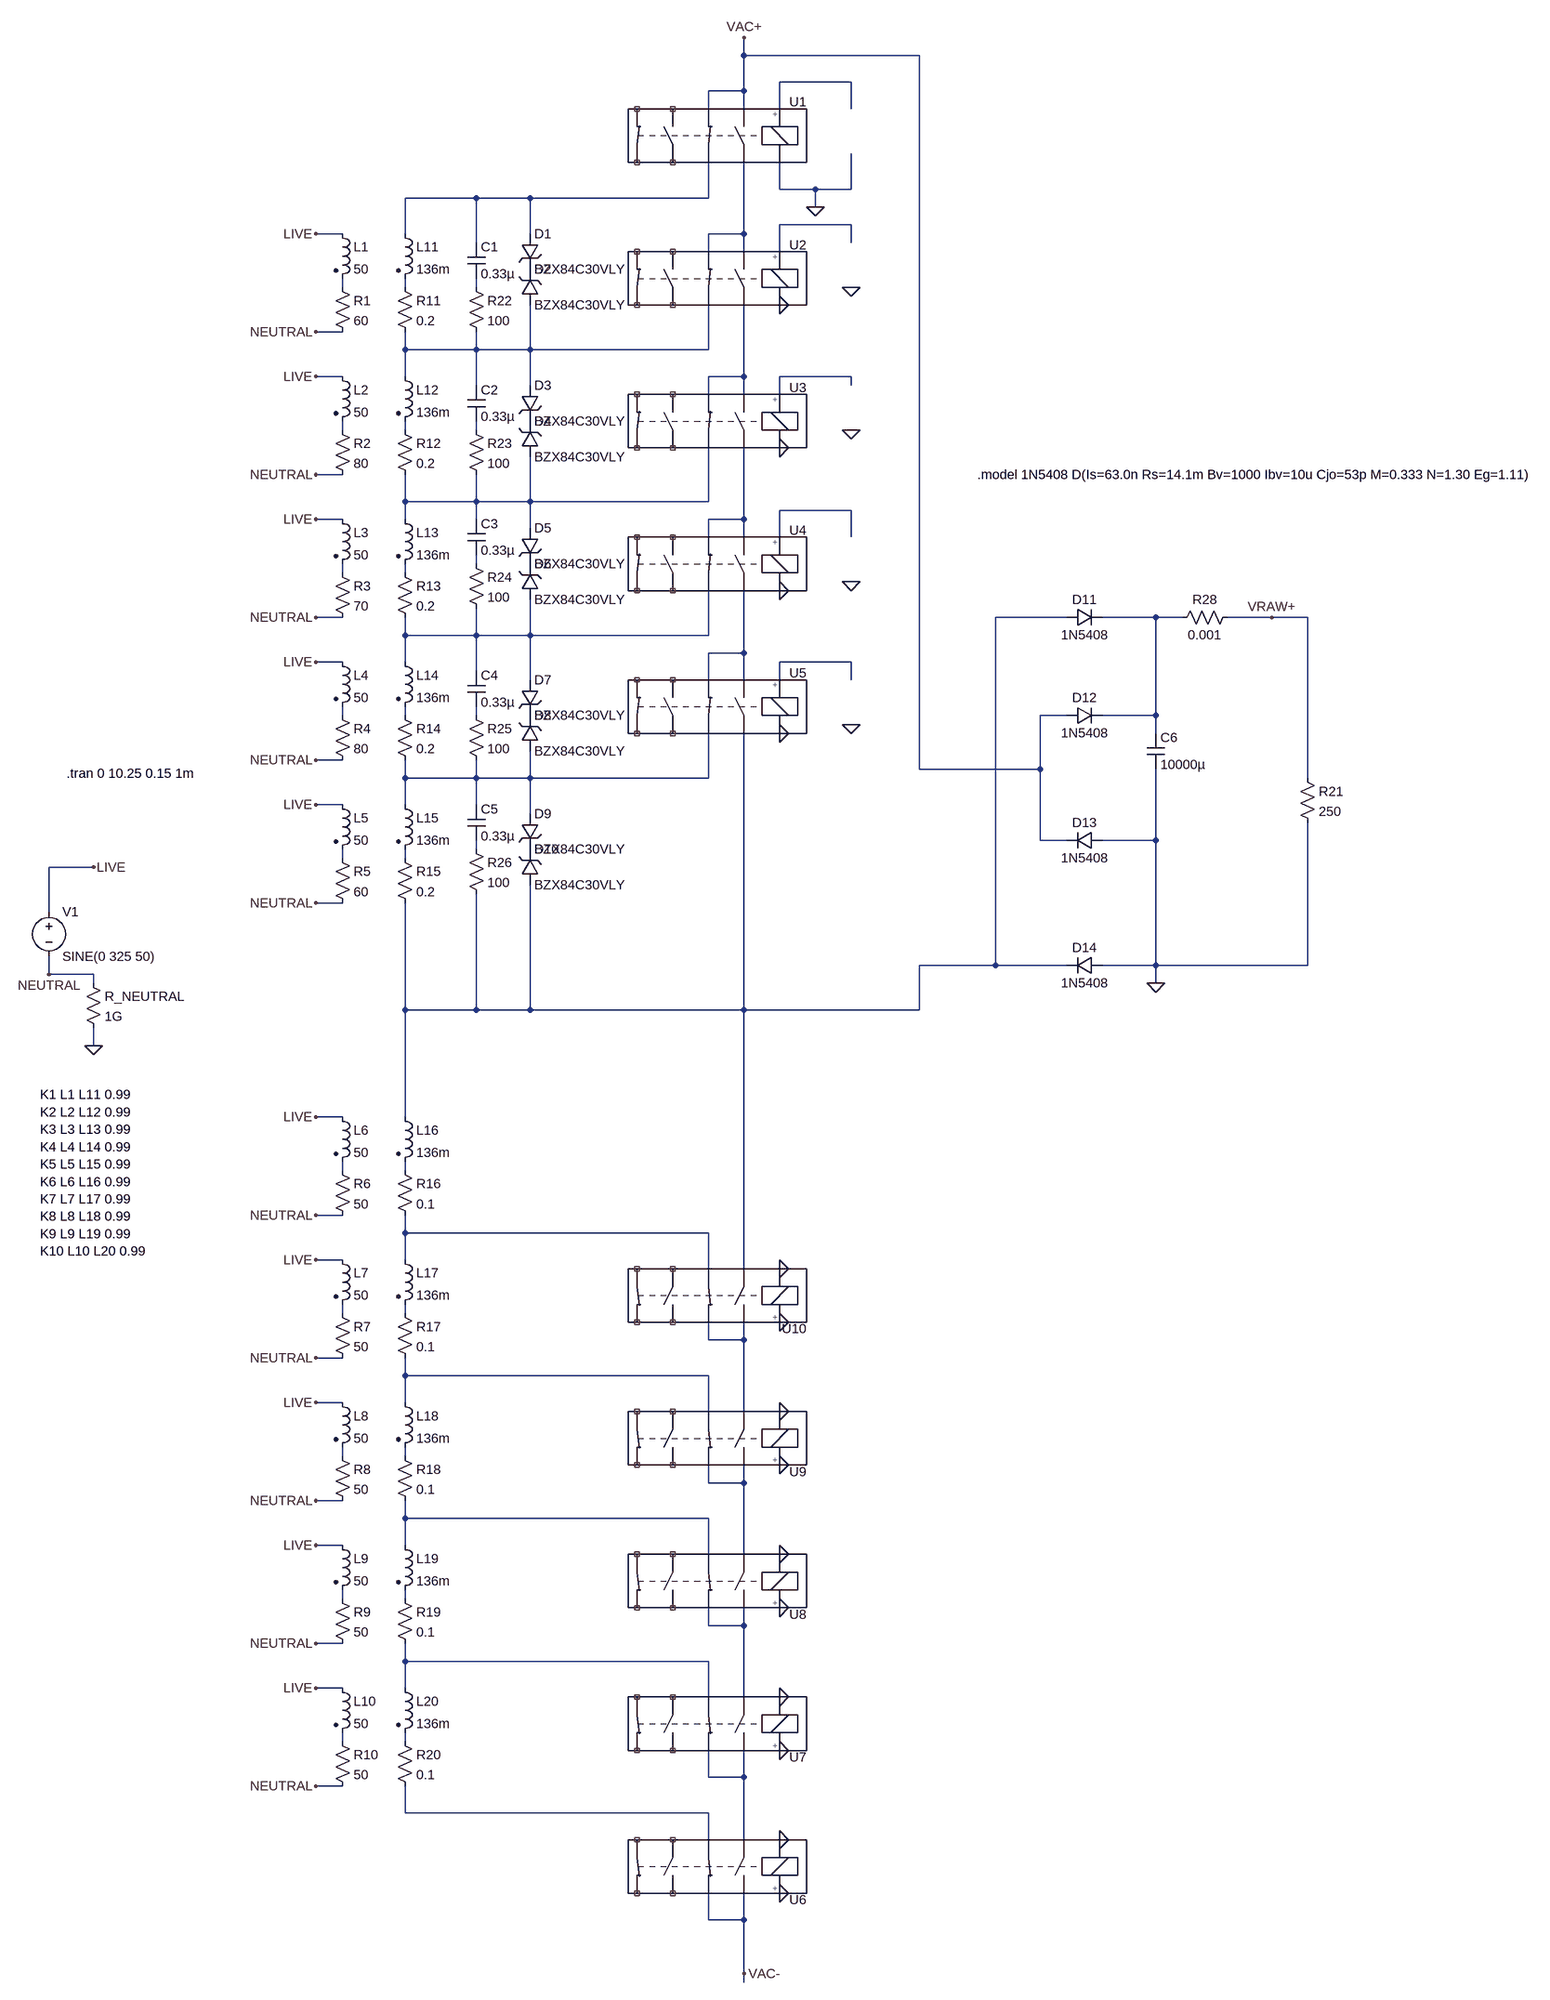
[diagram p0: schematic psu.asc]
psu.asc, the LTspice schematic file:
Version 4
SHEET 1 2216 3296
WIRE 496 -208 496 -240
WIRE 1056 -208 496 -208
WIRE 688 -160 560 -160
WIRE 496 -144 496 -208
WIRE 496 -144 432 -144
WIRE 432 -112 432 -144
WIRE 496 -112 496 -144
WIRE 560 -112 560 -160
WIRE 688 -112 688 -160
WIRE 560 32 560 -16
WIRE 624 32 560 32
WIRE 688 32 688 -32
WIRE 688 32 624 32
WIRE 16 48 -112 48
WIRE 112 48 16 48
WIRE 432 48 432 -16
WIRE 432 48 112 48
WIRE 624 64 624 32
WIRE 688 96 560 96
WIRE -224 112 -272 112
WIRE -112 112 -112 48
WIRE 112 112 112 48
WIRE 496 112 496 -16
WIRE 496 112 432 112
WIRE 16 128 16 48
WIRE 688 128 688 96
WIRE 432 144 432 112
WIRE 496 144 496 112
WIRE 560 144 560 96
WIRE -224 208 -224 192
WIRE -112 208 -112 192
WIRE 16 208 16 192
WIRE -224 288 -272 288
WIRE -112 320 -112 288
WIRE 16 320 16 288
WIRE 16 320 -112 320
WIRE 112 320 112 240
WIRE 112 320 16 320
WIRE 432 320 432 240
WIRE 432 320 112 320
WIRE -224 368 -272 368
WIRE -112 368 -112 320
WIRE 496 368 496 240
WIRE 496 368 432 368
WIRE 688 368 560 368
WIRE 16 384 16 320
WIRE 112 384 112 320
WIRE 688 384 688 368
WIRE 432 400 432 368
WIRE 496 400 496 368
WIRE 560 400 560 368
WIRE -224 464 -224 448
WIRE -112 464 -112 448
WIRE 16 464 16 448
WIRE -224 544 -272 544
WIRE -112 592 -112 544
WIRE 16 592 16 544
WIRE 16 592 -112 592
WIRE 112 592 112 512
WIRE 112 592 16 592
WIRE 432 592 432 496
WIRE 432 592 112 592
WIRE 688 608 560 608
WIRE -224 624 -272 624
WIRE -112 624 -112 592
WIRE 16 624 16 592
WIRE 496 624 496 496
WIRE 496 624 432 624
WIRE 112 640 112 592
WIRE 432 656 432 624
WIRE 496 656 496 624
WIRE 560 656 560 608
WIRE 688 656 688 608
WIRE 16 704 16 688
WIRE -224 720 -224 704
WIRE -112 720 -112 704
WIRE -224 800 -272 800
WIRE 1360 800 1232 800
WIRE 1520 800 1424 800
WIRE 1568 800 1520 800
WIRE 1728 800 1648 800
WIRE 1792 800 1728 800
WIRE -112 832 -112 800
WIRE 16 832 16 784
WIRE 16 832 -112 832
WIRE 112 832 112 768
WIRE 112 832 16 832
WIRE 432 832 432 752
WIRE 432 832 112 832
WIRE 496 864 496 752
WIRE 496 864 432 864
WIRE -224 880 -272 880
WIRE -112 880 -112 832
WIRE 688 880 560 880
WIRE 16 896 16 832
WIRE 112 912 112 832
WIRE 432 912 432 864
WIRE 496 912 496 864
WIRE 560 912 560 880
WIRE 688 912 688 880
WIRE -224 976 -224 960
WIRE -112 976 -112 960
WIRE 16 976 16 960
WIRE 1360 976 1312 976
WIRE 1520 976 1520 800
WIRE 1520 976 1424 976
WIRE 1520 1008 1520 976
WIRE -224 1056 -272 1056
WIRE 1056 1072 1056 -208
WIRE 1312 1072 1312 976
WIRE 1312 1072 1056 1072
WIRE -112 1088 -112 1056
WIRE 16 1088 16 1056
WIRE 16 1088 -112 1088
WIRE 112 1088 112 1040
WIRE 112 1088 16 1088
WIRE 432 1088 432 1008
WIRE 432 1088 112 1088
WIRE 1792 1088 1792 800
WIRE -224 1136 -272 1136
WIRE -112 1136 -112 1088
WIRE 16 1136 16 1088
WIRE 112 1152 112 1088
WIRE 1312 1200 1312 1072
WIRE 1360 1200 1312 1200
WIRE 1520 1200 1520 1072
WIRE 1520 1200 1424 1200
WIRE 16 1216 16 1200
WIRE -224 1232 -224 1216
WIRE -112 1232 -112 1216
WIRE -816 1248 -896 1248
WIRE -224 1312 -272 1312
WIRE -896 1328 -896 1248
WIRE 1232 1424 1232 800
WIRE 1232 1424 1056 1424
WIRE 1360 1424 1232 1424
WIRE 1520 1424 1520 1200
WIRE 1520 1424 1424 1424
WIRE 1792 1424 1792 1168
WIRE 1792 1424 1520 1424
WIRE -896 1440 -896 1408
WIRE -816 1440 -896 1440
WIRE -816 1456 -816 1440
WIRE 1520 1456 1520 1424
WIRE -112 1504 -112 1312
WIRE 16 1504 16 1296
WIRE 16 1504 -112 1504
WIRE 112 1504 112 1280
WIRE 112 1504 16 1504
WIRE 496 1504 496 1008
WIRE 496 1504 112 1504
WIRE 1056 1504 1056 1424
WIRE 1056 1504 496 1504
WIRE -816 1568 -816 1536
WIRE -224 1696 -272 1696
WIRE -112 1696 -112 1504
WIRE -224 1792 -224 1776
WIRE -112 1792 -112 1776
WIRE -224 1872 -272 1872
WIRE -112 1904 -112 1872
WIRE 432 1904 -112 1904
WIRE -224 1952 -272 1952
WIRE -112 1952 -112 1904
WIRE 432 1968 432 1904
WIRE 496 1968 496 1504
WIRE -224 2048 -224 2032
WIRE -112 2048 -112 2032
WIRE 432 2096 432 2064
WIRE 496 2096 496 2064
WIRE 496 2096 432 2096
WIRE -224 2128 -272 2128
WIRE -112 2160 -112 2128
WIRE 432 2160 -112 2160
WIRE -224 2208 -272 2208
WIRE -112 2208 -112 2160
WIRE 432 2224 432 2160
WIRE 496 2224 496 2096
WIRE -224 2304 -224 2288
WIRE -112 2304 -112 2288
WIRE 432 2352 432 2320
WIRE 496 2352 496 2320
WIRE 496 2352 432 2352
WIRE -224 2384 -272 2384
WIRE -112 2416 -112 2384
WIRE 432 2416 -112 2416
WIRE -224 2464 -272 2464
WIRE -112 2464 -112 2416
WIRE 432 2480 432 2416
WIRE 496 2480 496 2352
WIRE -224 2560 -224 2544
WIRE -112 2560 -112 2544
WIRE 432 2608 432 2576
WIRE 496 2608 496 2576
WIRE 496 2608 432 2608
WIRE -224 2640 -272 2640
WIRE -112 2672 -112 2640
WIRE 432 2672 -112 2672
WIRE -224 2720 -272 2720
WIRE -112 2720 -112 2672
WIRE 432 2736 432 2672
WIRE 496 2736 496 2608
WIRE -224 2816 -224 2800
WIRE -112 2816 -112 2800
WIRE 432 2880 432 2832
WIRE 496 2880 496 2832
WIRE 496 2880 432 2880
WIRE -224 2896 -272 2896
WIRE -112 2944 -112 2896
WIRE 432 2944 -112 2944
WIRE 432 2992 432 2944
WIRE 496 2992 496 2880
WIRE 432 3136 432 3088
WIRE 496 3136 496 3088
WIRE 496 3136 432 3136
WIRE 496 3232 496 3136
WIRE 496 3248 496 3232
FLAG -272 112 LIVE
FLAG -272 368 LIVE
FLAG -272 624 LIVE
FLAG -272 880 LIVE
FLAG -272 1136 LIVE
FLAG -272 1696 LIVE
FLAG -272 1952 LIVE
FLAG -272 2208 LIVE
FLAG -272 2464 LIVE
FLAG -272 2720 LIVE
FLAG -272 288 NEUTRAL
FLAG -272 544 NEUTRAL
FLAG -272 800 NEUTRAL
FLAG -272 1056 NEUTRAL
FLAG -272 1312 NEUTRAL
FLAG -272 1872 NEUTRAL
FLAG -272 2128 NEUTRAL
FLAG -272 2384 NEUTRAL
FLAG -272 2640 NEUTRAL
FLAG -272 2896 NEUTRAL
FLAG -816 1568 0
FLAG -896 1440 NEUTRAL
FLAG -816 1248 LIVE
FLAG 496 -240 VAC+
FLAG 496 3232 VAC-
FLAG 624 64 0
FLAG 560 240 0
FLAG 560 496 0
FLAG 560 752 0
FLAG 560 1008 0
FLAG 560 3088 0
FLAG 560 2992 0
FLAG 560 2832 0
FLAG 560 2736 0
FLAG 560 2576 0
FLAG 560 2480 0
FLAG 560 2320 0
FLAG 560 2224 0
FLAG 560 2064 0
FLAG 560 1968 0
FLAG 688 992 0
FLAG 688 736 0
FLAG 688 464 0
FLAG 688 208 0
FLAG 1520 1456 0
FLAG 1728 800 VRAW+
SYMBOL ind2 -240 96 R0
SYMATTR InstName L1
SYMATTR Value 50
SYMATTR Type ind
SYMBOL Res -240 192 R0
SYMATTR InstName R1
SYMATTR Value 60
SYMBOL ind2 -240 352 R0
SYMATTR InstName L2
SYMATTR Value 50
SYMATTR Type ind
SYMBOL Res -240 448 R0
SYMATTR InstName R2
SYMATTR Value 80
SYMBOL ind2 -240 608 R0
SYMATTR InstName L3
SYMATTR Value 50
SYMATTR Type ind
SYMBOL Res -240 704 R0
SYMATTR InstName R3
SYMATTR Value 70
SYMBOL ind2 -240 864 R0
SYMATTR InstName L4
SYMATTR Value 50
SYMATTR Type ind
SYMBOL Res -240 960 R0
SYMATTR InstName R4
SYMATTR Value 80
SYMBOL ind2 -240 1120 R0
SYMATTR InstName L5
SYMATTR Value 50
SYMATTR Type ind
SYMBOL Res -240 1216 R0
SYMATTR InstName R5
SYMATTR Value 60
SYMBOL ind2 -240 1680 R0
SYMATTR InstName L6
SYMATTR Value 50
SYMATTR Type ind
SYMBOL Res -240 1776 R0
SYMATTR InstName R6
SYMATTR Value 50
SYMBOL ind2 -240 1936 R0
SYMATTR InstName L7
SYMATTR Value 50
SYMATTR Type ind
SYMBOL Res -240 2032 R0
SYMATTR InstName R7
SYMATTR Value 50
SYMBOL ind2 -240 2192 R0
SYMATTR InstName L8
SYMATTR Value 50
SYMATTR Type ind
SYMBOL Res -240 2288 R0
SYMATTR InstName R8
SYMATTR Value 50
SYMBOL ind2 -240 2448 R0
SYMATTR InstName L9
SYMATTR Value 50
SYMATTR Type ind
SYMBOL Res -240 2544 R0
SYMATTR InstName R9
SYMATTR Value 50
SYMBOL ind2 -240 2704 R0
SYMATTR InstName L10
SYMATTR Value 50
SYMATTR Type ind
SYMBOL Res -240 2800 R0
SYMATTR InstName R10
SYMATTR Value 50
SYMBOL ind2 -128 96 R0
SYMATTR InstName L11
SYMATTR Value 136m
SYMATTR Type ind
SYMBOL Res -128 192 R0
SYMATTR InstName R11
SYMATTR Value 0.2
SYMBOL ind2 -128 352 R0
SYMATTR InstName L12
SYMATTR Value 136m
SYMATTR Type ind
SYMBOL Res -128 448 R0
SYMATTR InstName R12
SYMATTR Value 0.2
SYMBOL ind2 -128 608 R0
SYMATTR InstName L13
SYMATTR Value 136m
SYMATTR Type ind
SYMBOL Res -128 704 R0
SYMATTR InstName R13
SYMATTR Value 0.2
SYMBOL ind2 -128 864 R0
SYMATTR InstName L14
SYMATTR Value 136m
SYMATTR Type ind
SYMBOL Res -128 960 R0
SYMATTR InstName R14
SYMATTR Value 0.2
SYMBOL ind2 -128 1120 R0
SYMATTR InstName L15
SYMATTR Value 136m
SYMATTR Type ind
SYMBOL Res -128 1216 R0
SYMATTR InstName R15
SYMATTR Value 0.2
SYMBOL ind2 -128 1680 R0
SYMATTR InstName L16
SYMATTR Value 136m
SYMATTR Type ind
SYMBOL Res -128 1776 R0
SYMATTR InstName R16
SYMATTR Value 0.1
SYMBOL ind2 -128 1936 R0
SYMATTR InstName L17
SYMATTR Value 136m
SYMATTR Type ind
SYMBOL Res -128 2032 R0
SYMATTR InstName R17
SYMATTR Value 0.1
SYMBOL ind2 -128 2192 R0
SYMATTR InstName L18
SYMATTR Value 136m
SYMATTR Type ind
SYMBOL Res -128 2288 R0
SYMATTR InstName R18
SYMATTR Value 0.1
SYMBOL ind2 -128 2448 R0
SYMATTR InstName L19
SYMATTR Value 136m
SYMATTR Type ind
SYMBOL Res -128 2544 R0
SYMATTR InstName R19
SYMATTR Value 0.1
SYMBOL ind2 -128 2704 R0
SYMATTR InstName L20
SYMATTR Value 136m
SYMATTR Type ind
SYMBOL Res -128 2800 R0
SYMATTR InstName R20
SYMATTR Value 0.1
SYMBOL voltage -896 1312 R0
SYMATTR InstName V1
SYMATTR Value SINE(0 325 50)
SYMBOL Res -832 1440 R0
SYMATTR InstName R_NEUTRAL
SYMATTR Value 1G
SYMBOL Relay_2A2B 512 -64 M0
SYMATTR InstName U1
SYMATTR SpiceModel Relay_2A2B_Bounce
SYMBOL Relay_2A2B 512 192 M0
SYMATTR InstName U2
SYMATTR SpiceModel Relay_2A2B_Bounce
SYMBOL Relay_2A2B 512 448 M0
SYMATTR InstName U3
SYMATTR SpiceModel Relay_2A2B_Bounce
SYMBOL Relay_2A2B 512 704 M0
SYMATTR InstName U4
SYMBOL Relay_2A2B 512 960 M0
SYMATTR InstName U5
SYMATTR SpiceModel Relay_2A2B_Bounce
SYMBOL Relay_2A2B 512 3040 R180
SYMATTR InstName U6
SYMATTR SpiceModel Relay_2A2B_Bounce
SYMBOL Relay_2A2B 512 2784 R180
SYMATTR InstName U7
SYMBOL Relay_2A2B 512 2528 R180
SYMATTR InstName U8
SYMATTR SpiceModel Relay_2A2B_Bounce
SYMBOL Relay_2A2B 512 2272 R180
SYMATTR InstName U9
SYMBOL Relay_2A2B 512 2016 R180
SYMATTR InstName U10
SYMATTR SpiceModel Relay_2A2B_Bounce
SYMBOL Cap 0 128 R0
SYMATTR InstName C1
SYMATTR Value 0.33µ
SYMBOL Res 0 192 R0
SYMATTR InstName R22
SYMATTR Value 100
SYMBOL Cap 0 384 R0
SYMATTR InstName C2
SYMATTR Value 0.33µ
SYMBOL Res 0 448 R0
SYMATTR InstName R23
SYMATTR Value 100
SYMBOL Cap 0 624 R0
SYMATTR InstName C3
SYMATTR Value 0.33µ
SYMBOL Res 0 688 R0
SYMATTR InstName R24
SYMATTR Value 100
SYMBOL Cap 0 896 R0
SYMATTR InstName C4
SYMATTR Value 0.33µ
SYMBOL Res 0 960 R0
SYMATTR InstName R25
SYMATTR Value 100
SYMBOL Cap 0 1136 R0
SYMATTR InstName C5
SYMATTR Value 0.33µ
SYMBOL Res 0 1200 R0
SYMATTR InstName R26
SYMATTR Value 100
SYMBOL zener 96 112 R0
SYMATTR InstName D1
SYMATTR Value BZX84C30VLY
SYMATTR Description Diode
SYMATTR Type diode
SYMBOL zener 96 240 M180
WINDOW 0 24 64 Left 2
WINDOW 3 24 0 Left 2
SYMATTR InstName D2
SYMATTR Value BZX84C30VLY
SYMATTR Description Diode
SYMATTR Type diode
SYMBOL zener 96 384 R0
SYMATTR InstName D3
SYMATTR Value BZX84C30VLY
SYMATTR Description Diode
SYMATTR Type diode
SYMBOL zener 96 512 M180
WINDOW 0 24 64 Left 2
WINDOW 3 24 0 Left 2
SYMATTR InstName D4
SYMATTR Value BZX84C30VLY
SYMATTR Description Diode
SYMATTR Type diode
SYMBOL zener 96 640 R0
SYMATTR InstName D5
SYMATTR Value BZX84C30VLY
SYMATTR Description Diode
SYMATTR Type diode
SYMBOL zener 96 768 M180
WINDOW 0 24 64 Left 2
WINDOW 3 24 0 Left 2
SYMATTR InstName D6
SYMATTR Value BZX84C30VLY
SYMATTR Description Diode
SYMATTR Type diode
SYMBOL zener 96 912 R0
SYMATTR InstName D7
SYMATTR Value BZX84C30VLY
SYMATTR Description Diode
SYMATTR Type diode
SYMBOL zener 96 1040 M180
WINDOW 0 24 64 Left 2
WINDOW 3 24 0 Left 2
SYMATTR InstName D8
SYMATTR Value BZX84C30VLY
SYMATTR Description Diode
SYMATTR Type diode
SYMBOL zener 96 1152 R0
SYMATTR InstName D9
SYMATTR Value BZX84C30VLY
SYMATTR Description Diode
SYMATTR Type diode
SYMBOL zener 96 1280 M180
WINDOW 0 24 64 Left 2
WINDOW 3 24 0 Left 2
SYMATTR InstName D10
SYMATTR Value BZX84C30VLY
SYMATTR Description Diode
SYMATTR Type diode
SYMBOL Diode 1360 816 R270
WINDOW 0 32 32 VTop 2
WINDOW 3 0 32 VBottom 2
SYMATTR InstName D11
SYMATTR Value 1N5408
SYMBOL Diode 1360 992 R270
WINDOW 0 32 32 VTop 2
WINDOW 3 0 32 VBottom 2
SYMATTR InstName D12
SYMATTR Value 1N5408
SYMBOL Diode 1424 1184 R90
WINDOW 0 0 32 VBottom 2
WINDOW 3 32 32 VTop 2
SYMATTR InstName D13
SYMATTR Value 1N5408
SYMBOL Diode 1424 1408 R90
WINDOW 0 0 32 VBottom 2
WINDOW 3 32 32 VTop 2
SYMATTR InstName D14
SYMATTR Value 1N5408
SYMBOL Cap 1504 1008 R0
SYMATTR InstName C6
SYMATTR Value 10000µ
SYMBOL Res 1664 784 R90
WINDOW 0 0 56 VBottom 2
WINDOW 3 32 56 VTop 2
SYMATTR InstName R28
SYMATTR Value 0.001
SYMBOL Res 1776 1072 R0
SYMATTR InstName R21
SYMATTR Value 250
TEXT -864 1080 Left 2 !.tran 0 10.25 0.15 1m
TEXT -912 1656 Left 2 !K1 L1 L11 0.99\nK2 L2 L12 0.99\nK3 L3 L13 0.99\nK4 L4 L14 0.99\nK5 L5 L15 0.99\nK6 L6 L16 0.99\nK7 L7 L17 0.99\nK8 L8 L18 0.99\nK9 L9 L19 0.99\nK10 L10 L20 0.99
TEXT 1200 544 Left 2 !.model 1N5408 D(Is=63.0n Rs=14.1m Bv=1000 Ibv=10u Cjo=53p M=0.333 N=1.30 Eg=1.11)

The netlist it stands for:
* psu.asc
L1 LIVE N005 50
R1 N005 NEUTRAL 60
L2 LIVE N011 50
R2 N011 NEUTRAL 80
L3 LIVE N018 50
R3 N018 NEUTRAL 70
L4 LIVE N025 50
R4 N025 NEUTRAL 80
L5 LIVE N030 50
R5 N030 NEUTRAL 60
L6 LIVE N032 50
R6 N032 NEUTRAL 50
L7 LIVE N035 50
R7 N035 NEUTRAL 50
L8 LIVE N039 50
R8 N039 NEUTRAL 50
L9 LIVE N043 50
R9 N043 NEUTRAL 50
L10 LIVE N047 50
R10 N047 NEUTRAL 50
L11 N002 N006 136m
R11 N006 N008 0.2
L12 N008 N012 136m
R12 N012 N014 0.2
L13 N014 N019 136m
R13 N019 N022 0.2
L14 N022 N026 136m
R14 N026 N028 0.2
L15 N028 N031 136m
R15 N031 N020 0.2
L16 N020 N033 136m
R16 N033 N034 0.1
L17 N034 N036 136m
R17 N036 N038 0.1
L18 N038 N040 136m
R18 N040 N042 0.1
L19 N042 N044 136m
R19 N044 N046 0.1
L20 N046 N048 136m
R20 N048 N050 0.1
V1 LIVE NEUTRAL SINE(0 325 50)
R_NEUTRAL NEUTRAL 0 1G
XU1 N001 0 VAC+ N004 VAC+ N002 NC_01 NC_02 NC_03 NC_04 Relay_2A2B_Bounce  ; pins Coil+ Coil- NO11 NO12 NC11 NC12 NO21 NO22 NC21 NC22
XU2 N003 0 N004 N009 N004 N008 NC_05 NC_06 NC_07 NC_08 Relay_2A2B_Bounce  ; pins Coil+ Coil- NO11 NO12 NC11 NC12 NO21 NO22 NC21 NC22
XU3 N010 0 N009 N016 N009 N014 NC_09 NC_10 NC_11 NC_12 Relay_2A2B_Bounce  ; pins Coil+ Coil- NO11 NO12 NC11 NC12 NO21 NO22 NC21 NC22
XU4 N015 0 N016 N023 N016 N022 NC_13 NC_14 NC_15 NC_16 Relay_2A2B  ; pins Coil+ Coil- NO11 NO12 NC11 NC12 NO21 NO22 NC21 NC22
XU5 N024 0 N023 N020 N023 N028 NC_17 NC_18 NC_19 NC_20 Relay_2A2B_Bounce  ; pins Coil+ Coil- NO11 NO12 NC11 NC12 NO21 NO22 NC21 NC22
XU6 0 0 VAC- N049 VAC- N050 NC_21 NC_22 NC_23 NC_24 Relay_2A2B_Bounce  ; pins Coil+ Coil- NO11 NO12 NC11 NC12 NO21 NO22 NC21 NC22
XU7 0 0 N049 N045 N049 N046 NC_25 NC_26 NC_27 NC_28 Relay_2A2B  ; pins Coil+ Coil- NO11 NO12 NC11 NC12 NO21 NO22 NC21 NC22
XU8 0 0 N045 N041 N045 N042 NC_29 NC_30 NC_31 NC_32 Relay_2A2B_Bounce  ; pins Coil+ Coil- NO11 NO12 NC11 NC12 NO21 NO22 NC21 NC22
XU9 0 0 N041 N037 N041 N038 NC_33 NC_34 NC_35 NC_36 Relay_2A2B  ; pins Coil+ Coil- NO11 NO12 NC11 NC12 NO21 NO22 NC21 NC22
XU10 0 0 N037 N020 N037 N034 NC_37 NC_38 NC_39 NC_40 Relay_2A2B_Bounce  ; pins Coil+ Coil- NO11 NO12 NC11 NC12 NO21 NO22 NC21 NC22
C1 N002 N007 0.33µ
R22 N007 N008 100
C2 N008 N013 0.33µ
R23 N013 N014 100
C3 N014 N017 0.33µ
R24 N017 N022 100
C4 N022 N027 0.33µ
R25 N027 N028 100
C5 N028 N029 0.33µ
R26 N029 N020 100
D1 N002 P001 BZX84C30VLY
D2 N008 P001 BZX84C30VLY
D3 N008 P002 BZX84C30VLY
D4 N014 P002 BZX84C30VLY
D5 N014 P003 BZX84C30VLY
D6 N022 P003 BZX84C30VLY
D7 N022 P004 BZX84C30VLY
D8 N028 P004 BZX84C30VLY
D9 N028 P005 BZX84C30VLY
D10 N020 P005 BZX84C30VLY
D11 N020 N021 1N5408
D12 VAC+ N021 1N5408
D13 0 VAC+ 1N5408
D14 0 N020 1N5408
C6 N021 0 10000µ
R28 VRAW+ N021 0.001
R21 VRAW+ 0 250
.model D D
.lib standard.dio
.tran 0 10.25 0.15 1m
K1 L1 L11 0.99
K2 L2 L12 0.99
K3 L3 L13 0.99
K4 L4 L14 0.99
K5 L5 L15 0.99
K6 L6 L16 0.99
K7 L7 L17 0.99
K8 L8 L18 0.99
K9 L9 L19 0.99
K10 L10 L20 0.99
.model 1N5408 D(Is=63.0n Rs=14.1m Bv=1000 Ibv=10u Cjo=53p M=0.333 N=1.30 Eg=1.11)
.lib Relay_2A2B.sub
.backanno
.end